# EAGLE schematic attiny85 (EAGLE 9.5.2)
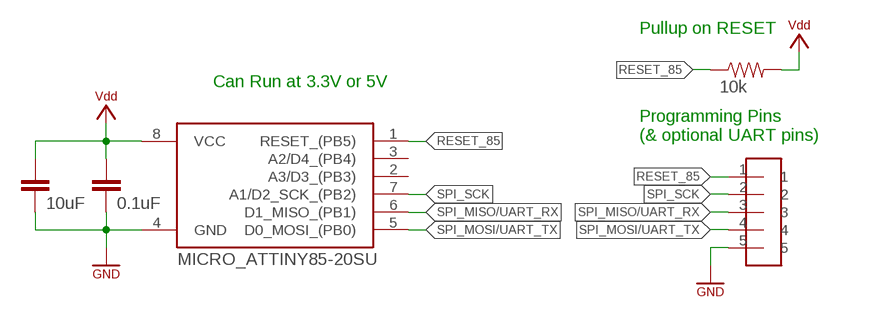
[diagram p0: schematic, sheet 1]

## Parts
C1  0.1uF  COMPONENT_CAP-0805  [0805]
C2  10uF  COMPONENT_CAP-0805  [0805]
R1  10k  COMPONENT_RESISTOR-0805  [0805]
U$1  MICRO_ATTINY85-20SU  [SOIC8]
U$2  HEADER-5-TESTPOINT  [TESTPOINT-5]

## Nets
GND: C1.2 C2.2 U$1.4(GND) U$2.5 ; supply symbol labelled SYMBOL_GND
RESET_85: R1.1 U$1.1(RESET_(PB5)) U$2.1
SPI_MISO/UART_RX: U$1.6(D1_MISO_(PB1)) U$2.3
SPI_MOSI/UART_TX: U$1.5(D0_MOSI_(PB0)) U$2.4
SPI_SCK: U$1.7(A1/D2_SCK_(PB2)) U$2.2
VDD: C1.1 C2.1 R1.2 U$1.8(VCC) ; supply symbol labelled SYMBOL_VDD
Unconnected: U$1.2(A3/D3_(PB3)) U$1.3(A2/D4_(PB4))

## Notes on the sheet
- Pullup on RESET
- Can Run at 3.3V or 5V
- Programming Pins
  (& optional UART pins)

## Library data of the parts
C1 C2 = homemade-hardware:COMPONENT_CAP: Capacitor Standard 0603 ceramic capacitor, and 0.1" leaded capacitor.
R1 = homemade-hardware:COMPONENT_RESISTOR
U$1 = homemade-hardware:MICRO_ATTINY85
U$2 = homemade-hardware:HEADER-5: NPTC081KFXC-RC <https://www.digikey.com/product-detail/en/sullins-connector-solutions/NPTC081KFXC-RC/S5600-ND/776058>: Vertical Female SMD Headers TSM-110-01-T-SV <https://www.digikey.com/product-detail/en/samtec-inc/TSM-110-01-T-SV/SAM12267-ND/6691889>: Vertical Male SMD Headers M20-8890845 <https://www.digikey.com/products/en?keywords=952-3236-ND>: Horizontal Male SMD Headers M20-7910842R <https://www.digikey.com/product-detail/en/harwin-inc/M20-7910842R/952-3200-6-ND/6559341>: Horizontal Female SMD Headers